# EAGLE design RobotArm (EAGLE 9.6.2)
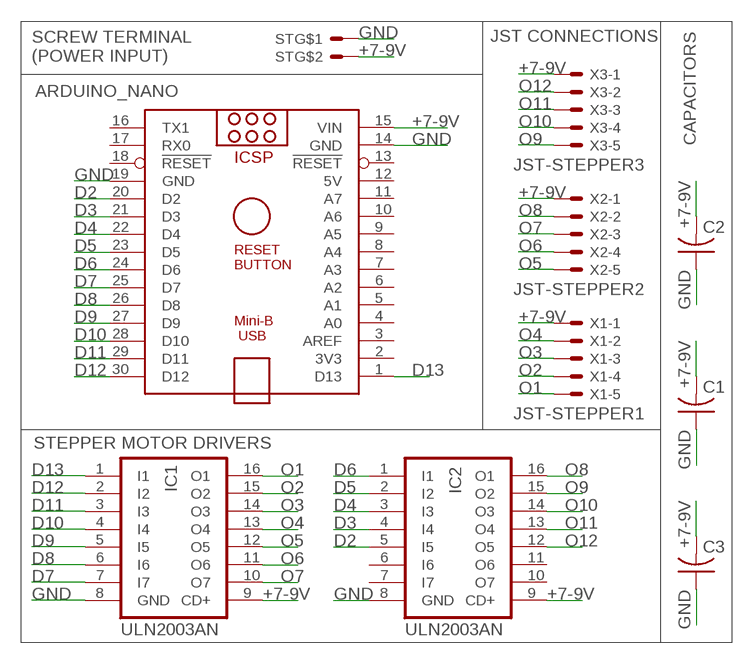
[diagram p0: schematic, sheet 1]

## Parts
ARDUINO_NANO  ARDUINO_NANO  [ARDUINO_NANO]
C1  C-US050-024X044  [C050-024X044]
C2  C-US050-024X044  [C050-024X044]
C3  C-US050-024X044  [C050-024X044]
IC1  ULN2003AN  [DIL16]
IC2  ULN2003AN  [DIL16]
ST  SCREWTERMINAL2.54  [2.54MM]
X1  JST-STEPPER1  JST-XH-05-PIN-LONG-PAD  [JST-XH-05-PACKAGE-LONG-PAD]
X2  JST-STEPPER2  JST-XH-05-PIN-LONG-PAD  [JST-XH-05-PACKAGE-LONG-PAD]
X3  JST-STEPPER3  JST-XH-05-PIN-LONG-PAD  [JST-XH-05-PACKAGE-LONG-PAD]

## Nets
+7-9V: ARDUINO_NANO.15(VIN) C1.2 C2.2 C3.2 IC1.9(CD+) IC2.9(CD+) ST.P$2 X1.1 X2.1 X3.1
D2: ARDUINO_NANO.20(D2) IC2.5(I5)
D3: ARDUINO_NANO.21(D3) IC2.4(I4)
D4: ARDUINO_NANO.22(D4) IC2.3(I3)
D5: ARDUINO_NANO.23(D5) IC2.2(I2)
D6: ARDUINO_NANO.24(D6) IC2.1(I1)
D7: ARDUINO_NANO.25(D7) IC1.7(I7)
D8: ARDUINO_NANO.26(D8) IC1.6(I6)
D9: ARDUINO_NANO.27(D9) IC1.5(I5)
D10: ARDUINO_NANO.28(D10) IC1.4(I4)
D11: ARDUINO_NANO.29(D11) IC1.3(I3)
D12: ARDUINO_NANO.30(D12) IC1.2(I2)
D13: ARDUINO_NANO.1(D13) IC1.1(I1)
GND: ARDUINO_NANO.14(GND) ARDUINO_NANO.19(GND) C1.1 C2.1 C3.1 IC1.8(GND) IC2.8(GND) ST.P$1
O1: IC1.16(O1) X1.5
O2: IC1.15(O2) X1.4
O3: IC1.14(O3) X1.3
O4: IC1.13(O4) X1.2
O5: IC1.12(O5) X2.5
O6: IC1.11(O6) X2.4
O7: IC1.10(O7) X2.3
O8: IC2.16(O1) X2.2
O9: IC2.15(O2) X3.5
O10: IC2.14(O3) X3.4
O11: IC2.13(O4) X3.3
O12: IC2.12(O5) X3.2
Unconnected: ARDUINO_NANO.2(3V3) ARDUINO_NANO.3(AREF) ARDUINO_NANO.4(A0) ARDUINO_NANO.5(A1) ARDUINO_NANO.6(A2) ARDUINO_NANO.7(A3) ARDUINO_NANO.8(A4) ARDUINO_NANO.9(A5) ARDUINO_NANO.10(A6) ARDUINO_NANO.11(A7) ARDUINO_NANO.13(!RESET) ARDUINO_NANO.16(TX1) ARDUINO_NANO.17(RX0) ARDUINO_NANO.18(!RESET) IC2.6(I6) IC2.7(I7) IC2.10(O7) IC2.11(O6)

## Notes on the sheet
- JST CONNECTIONS
- SCREW TERMINAL
  (POWER INPUT)
- CAPACITORS
- STEPPER MOTOR DRIVERS

## Power pins joined to a net without a drawn wire
5V: ARDUINO_NANO.12(5V)

## Library data of the parts
ARDUINO_NANO = ArduinoNano:ARDUINO_NANO: Arduino Nano V3.0 Overview: The Arduino Nano is a small, complete, and breadboard-friendly board based on the ATmega328 (Arduino Nano 3.x) or ATmega168 (Arduino Nano 2.x). It has more or less the same functionality of the Arduino Duemilanove, but in a different package. It lacks only a DC power jack, and works with a Mini-B USB cable instead of a standard one. The Nano was designed and is being produced by Gravitech. Specifications: Microcontroller Atmel ATmega168 or ATmega328 Operating Voltage (logic level) 5 V Input Voltage (recommended) 7-12 V Input Voltage (limits) 6-20 V Digital I/O Pins 14 (of which 6 provide PWM output) Analog Input Pins 8 DC Current per I/O Pin 40 mA Flash Memory 16 KB (ATmega168) or 32 KB (ATmega328) of which 2 KB used by bootloader SRAM 1 KB (ATmega168) or 2 KB (ATmega328) EEPROM 512 bytes (ATmega168) or 1 KB (ATmega328) Clock Speed 16 MHz Dimensions 0.73" x 1.70" Length 45 mm Width 18 mm Weigth 5 g Power: The Arduino Nano can be powered via the Mini-B USB connection, 6-20V unregulated external power supply (pin 30), or 5V regulated external power supply (pin 27). The power source is automatically selected to the highest voltage source. Memory: The ATmega168 has 16 KB of flash memory for storing code (of which 2 KB is used for the bootloader); the ATmega328 has 32 KB, (also with 2 KB used for the bootloader). The ATmega168 has 1 KB of SRAM and 512 bytes of EEPROM (which can be read and written with the EEPROM library); the ATmega328 has 2 KB of SRAM and 1 KB of EEPROM. Input and Output: Each of the 14 digital pins on the Nano can be used as an input or output, using pinMode(), digitalWrite(), and digitalRead() functions. They operate at 5 volts. Each pin can provide or receive a maximum of 40 mA and has an internal pull-up resistor (disconnected by default) of 20-50 kOhms. In addition, some pins have specialized functions. Visit Arduino - ArduinoBoardNano <https://www.arduino.cc/en/Main/ArduinoBoardNano>
C1-C3 = rcl:C-US: CAPACITOR, American symbol; SPICEPREFIX: C
IC1 IC2 = uln-udn:ULN2003A: DRIVER ARRAY
ST = MiniScrewTerminal:SCREWTERMINAL2.54
X1-X3 = JST-Connectors:JST-XH-05-PIN: JST XH Connector 2 Pin Wire to board connector. Pitch: 2,54 mm, (0.100") Number of pins: 5 Created by Rembrandt Electronics www.rembrandtelectronics.com

## Board
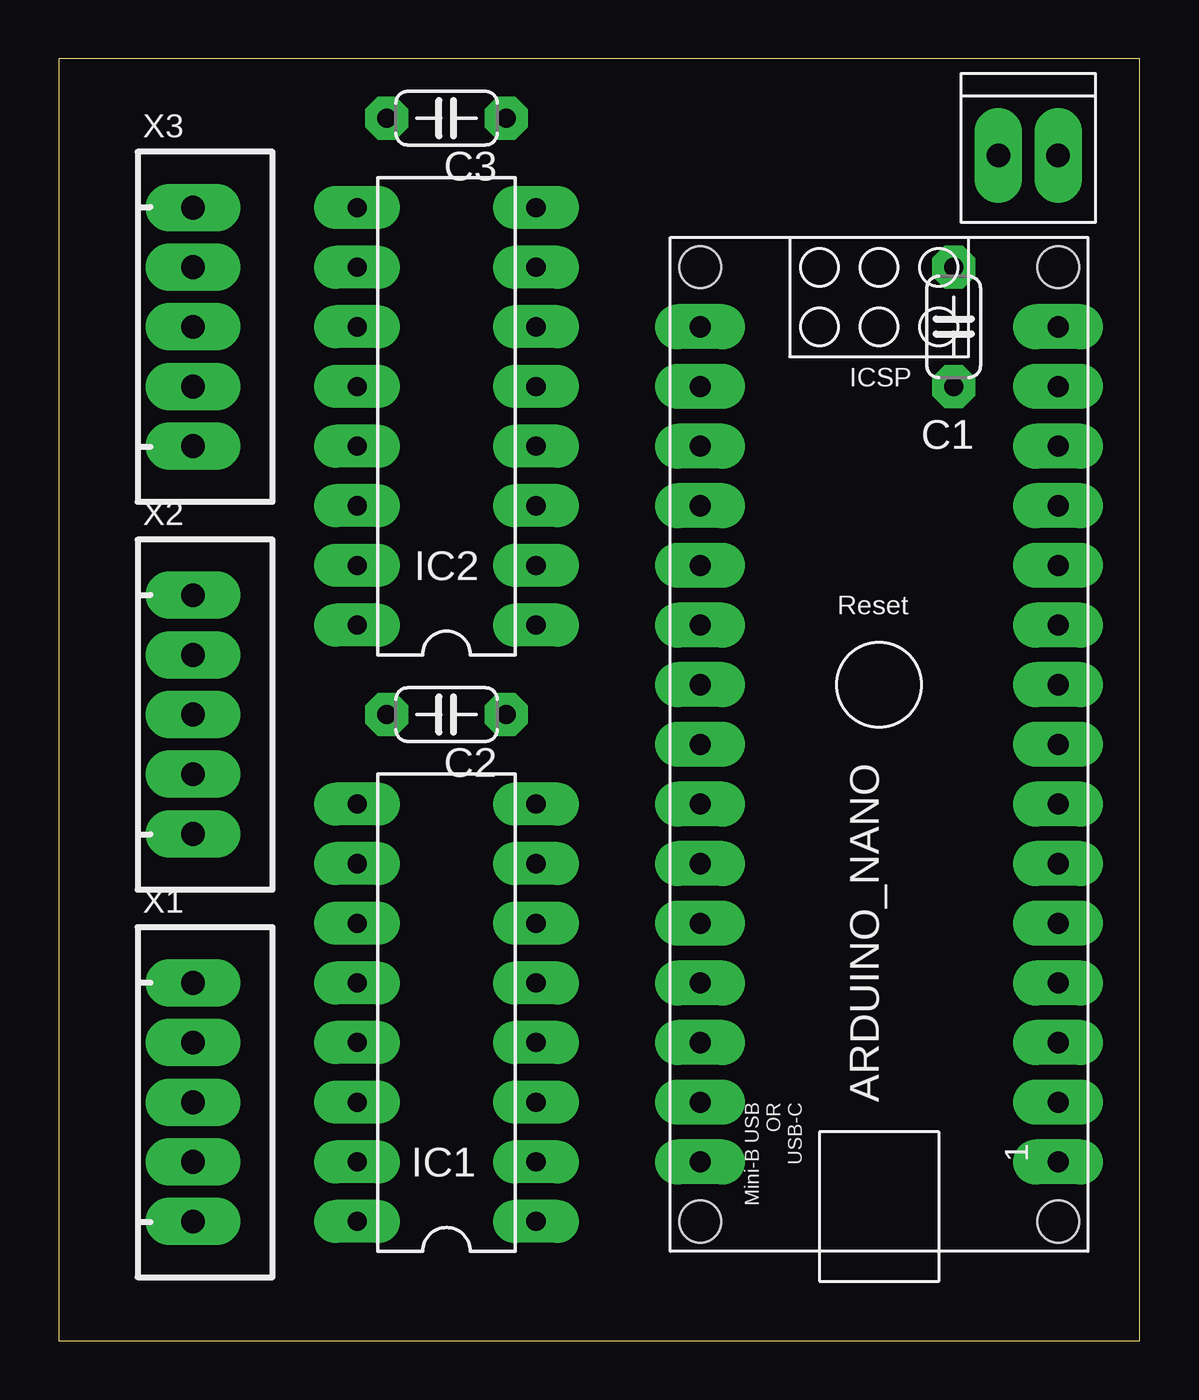
[diagram p1: board, top side]
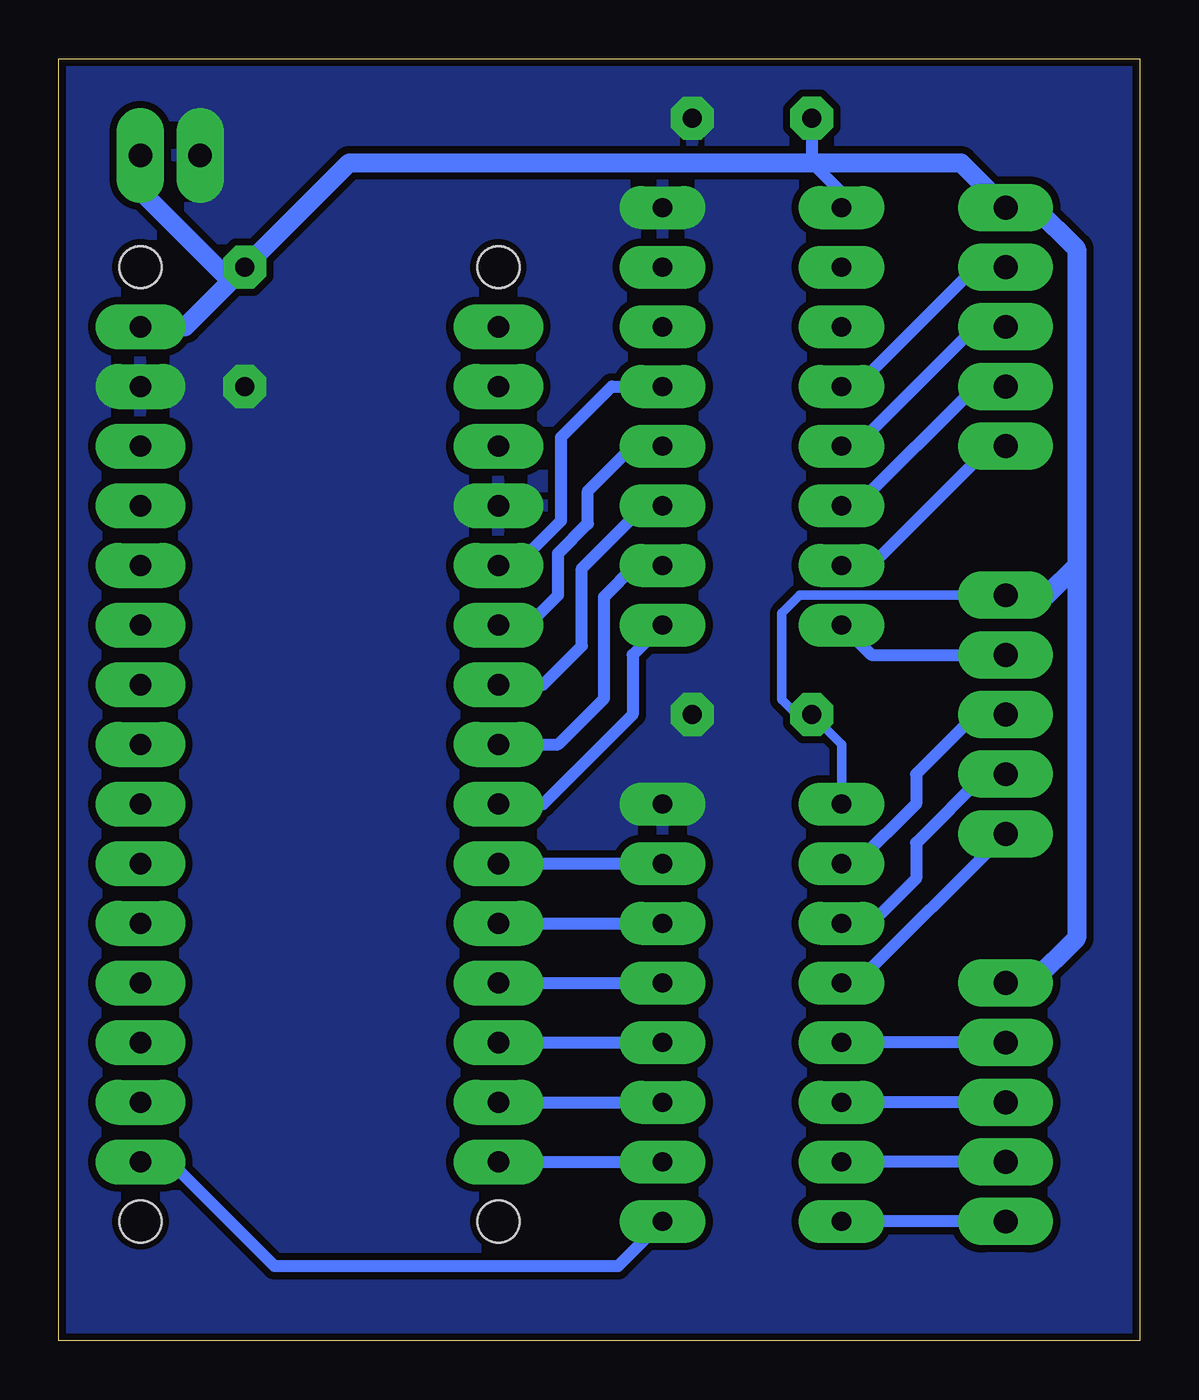
[diagram p2: board, bottom side, seen from below]

Size 46.02 x 54.6 mm. Coordinates in mm from the lower left corner, seen from the top.
Outline: 0,0 46.02,0 46.02,54.6 0,54.6 0,0
Copper layers (1*16): Top 0.035mm / dielectric 1.5mm / Bottom 0.035mm
Design rules "CNC *": minimum track width 20mil, minimum drill 0.3mm, track to track 12mil, track to pad 12mil, pad to pad 12mil, via to via 12mil, smd to smd 6mil, copper to edge 12mil, drill to drill 12mil, minimum pad ring 20mil, minimum via ring 8mil, stop-mask expansion 4mil, vias tented up to drill 0mil, thermal gap 0mil

### Footprints (pad centres in the part's own frame; a part is rotated, then mirrored left to right if it is on the bottom)
ARDUINO_NANO = drill 0.9 pad 1.422 long: 1 -20.32,-7.62; 2 -17.78,-7.62; 3 -15.24,-7.62; 4 -12.7,-7.62; 5 -10.16,-7.62; 6 -7.62,-7.62; 7 -5.08,-7.62; 8 -2.54,-7.62; 9 0,-7.62; 10 2.54,-7.62; 11 5.08,-7.62; 12 7.62,-7.62; 13 10.16,-7.62; 14 12.7,-7.62; 15 15.24,-7.62; 16 15.24,7.62; 17 12.7,7.62; 18 10.16,7.62; 19 7.62,7.62; 20 5.08,7.62; 21 2.54,7.62; 22 0,7.62; 23 -2.54,7.62; 24 -5.08,7.62; 25 -7.62,7.62; 26 -10.16,7.62; 27 -12.7,7.62; 28 -15.24,7.62; 29 -17.78,7.62; 30 -20.32,7.62 | hole 1.778: -22.86,-7.62; -22.86,7.62; 17.78,7.62; 17.78,-7.62
C050-024X044 = drill 0.813 octagon: 1 -2.54,0; 2 2.54,0
DIL16 = drill 0.813 long: 1 -8.89,-3.81; 2 -6.35,-3.81; 3 -3.81,-3.81; 4 -1.27,-3.81; 5 1.27,-3.81; 6 3.81,-3.81; 7 6.35,-3.81; 8 8.89,-3.81; 9 8.89,3.81; 10 6.35,3.81; 11 3.81,3.81; 12 1.27,3.81; 13 -1.27,3.81; 14 -3.81,3.81; 15 -6.35,3.81; 16 -8.89,3.81
2.54MM = drill 1 long: P$1 -1.27,-0.318; P$2 1.27,-0.318
JST-XH-05-PACKAGE-LONG-PAD = drill 1.016 long: 1 -5.08,0; 2 -2.54,0; 3 0,0; 4 2.54,0; 5 5.08,0

### Placement (x,y rotation side)
ARDUINO_NANO  34.92,27.94 90 top
C1  38.1,43.18 90 top
C2  16.51,26.67 180 top
C3  16.51,52.07 180 top
IC1  16.51,13.97 90 top
IC2  16.51,39.37 90 top
ST  41.27,50.8 0 top
X1  5.71,10.16 270 top
X2  5.71,26.67 270 top
X3  5.71,43.18 270 top

### Tracks (layer width: path | path; a pad name or v marks a point on that pad's centre or on a via)
+7-9V
  Bottom 0.406: IC1.9 12.7,25.4 C2.2 | 14.61,26.67 15.24,27.3 15.24,30.99 14.48,31.75 X2.1
  Bottom 0.508: IC2.9 12.7,48.9 13.97,50.16 C3.2 | C2.2 14.61,26.67
  Bottom 0.813: ARDUINO_NANO.15 40.64,43.18 C1.2 | ST.P$2 42.55,48.99 38.73,45.18 38.64,45.18 C1.2 | C1.2 38.05,45.77 33.66,50.16 13.97,50.16 7.62,50.16 X3.1 4.45,48.26 2.69,46.51 2.69,33.02 | 2.69,33.02 2.69,17.14 4.6,15.24 X1.1 | X2.1 3.96,31.75 2.69,33.02
D2
  Bottom 0.508: ARDUINO_NANO.20 26.54,33.02 24.64,34.92 24.64,38.48 22.48,40.64 IC2.5
D3
  Bottom 0.508: ARDUINO_NANO.21 26.04,30.48 24.77,31.75 24.77,33.53 23.5,34.8 23.5,36.2 21.59,38.1 IC2.4
D4
  Bottom 0.508: IC2.3 21.08,35.56 23.75,32.89 23.75,29.59 25.4,27.94 ARDUINO_NANO.22
D5
  Bottom 0.508: IC2.2 21.47,33.02 22.81,31.68 22.81,27.36 24.77,25.4 ARDUINO_NANO.23
D6
  Bottom 0.508: ARDUINO_NANO.24 25.4,22.86 21.59,26.67 21.59,29.21 IC2.1
D7
  Bottom 0.508: ARDUINO_NANO.25 IC1.7
D8
  Bottom 0.508: ARDUINO_NANO.26 IC1.6
D9
  Bottom 0.508: ARDUINO_NANO.27 IC1.5
D10
  Bottom 0.508: ARDUINO_NANO.28 IC1.4
D11
  Bottom 0.508: ARDUINO_NANO.29 IC1.3
D12
  Bottom 0.508: ARDUINO_NANO.30 IC1.2
D13
  Bottom 0.508: IC1.1 22.23,3.17 36.83,3.17 41.27,7.62 ARDUINO_NANO.1
GND
  pour Bottom: 0,0 47.62,0 47.62,55.24 0,55.24
O1
  Bottom 0.508: X1.5 IC1.16
O2
  Bottom 0.508: X1.4 IC1.15
O3
  Bottom 0.508: X1.3 IC1.14
O4
  Bottom 0.508: X1.2 IC1.13
O5
  Bottom 0.508: IC1.12 12.06,15.24 X2.5
O6
  Bottom 0.508: X2.4 6.6,24.13 9.53,21.21 9.53,19.68 11.43,17.78 IC1.11
O7
  Bottom 0.508: X2.3 6.99,26.67 9.53,24.13 9.53,22.86 12.06,20.32 IC1.10
O8
  Bottom 0.508: IC2.16 11.43,29.21 X2.2
O9
  Bottom 0.508: IC2.15 11.43,33.02 6.35,38.1 X3.5
O10
  Bottom 0.508: IC2.14 12.06,35.56 6.99,40.64 X3.4
O11
  Bottom 0.508: IC2.13 12.06,38.1 6.99,43.18 X3.3
O12
  Bottom 0.508: X3.2 6.99,45.72 12.06,40.64 IC2.12